# Altium project WirelessBoard_LCD20x4.PrjPcb
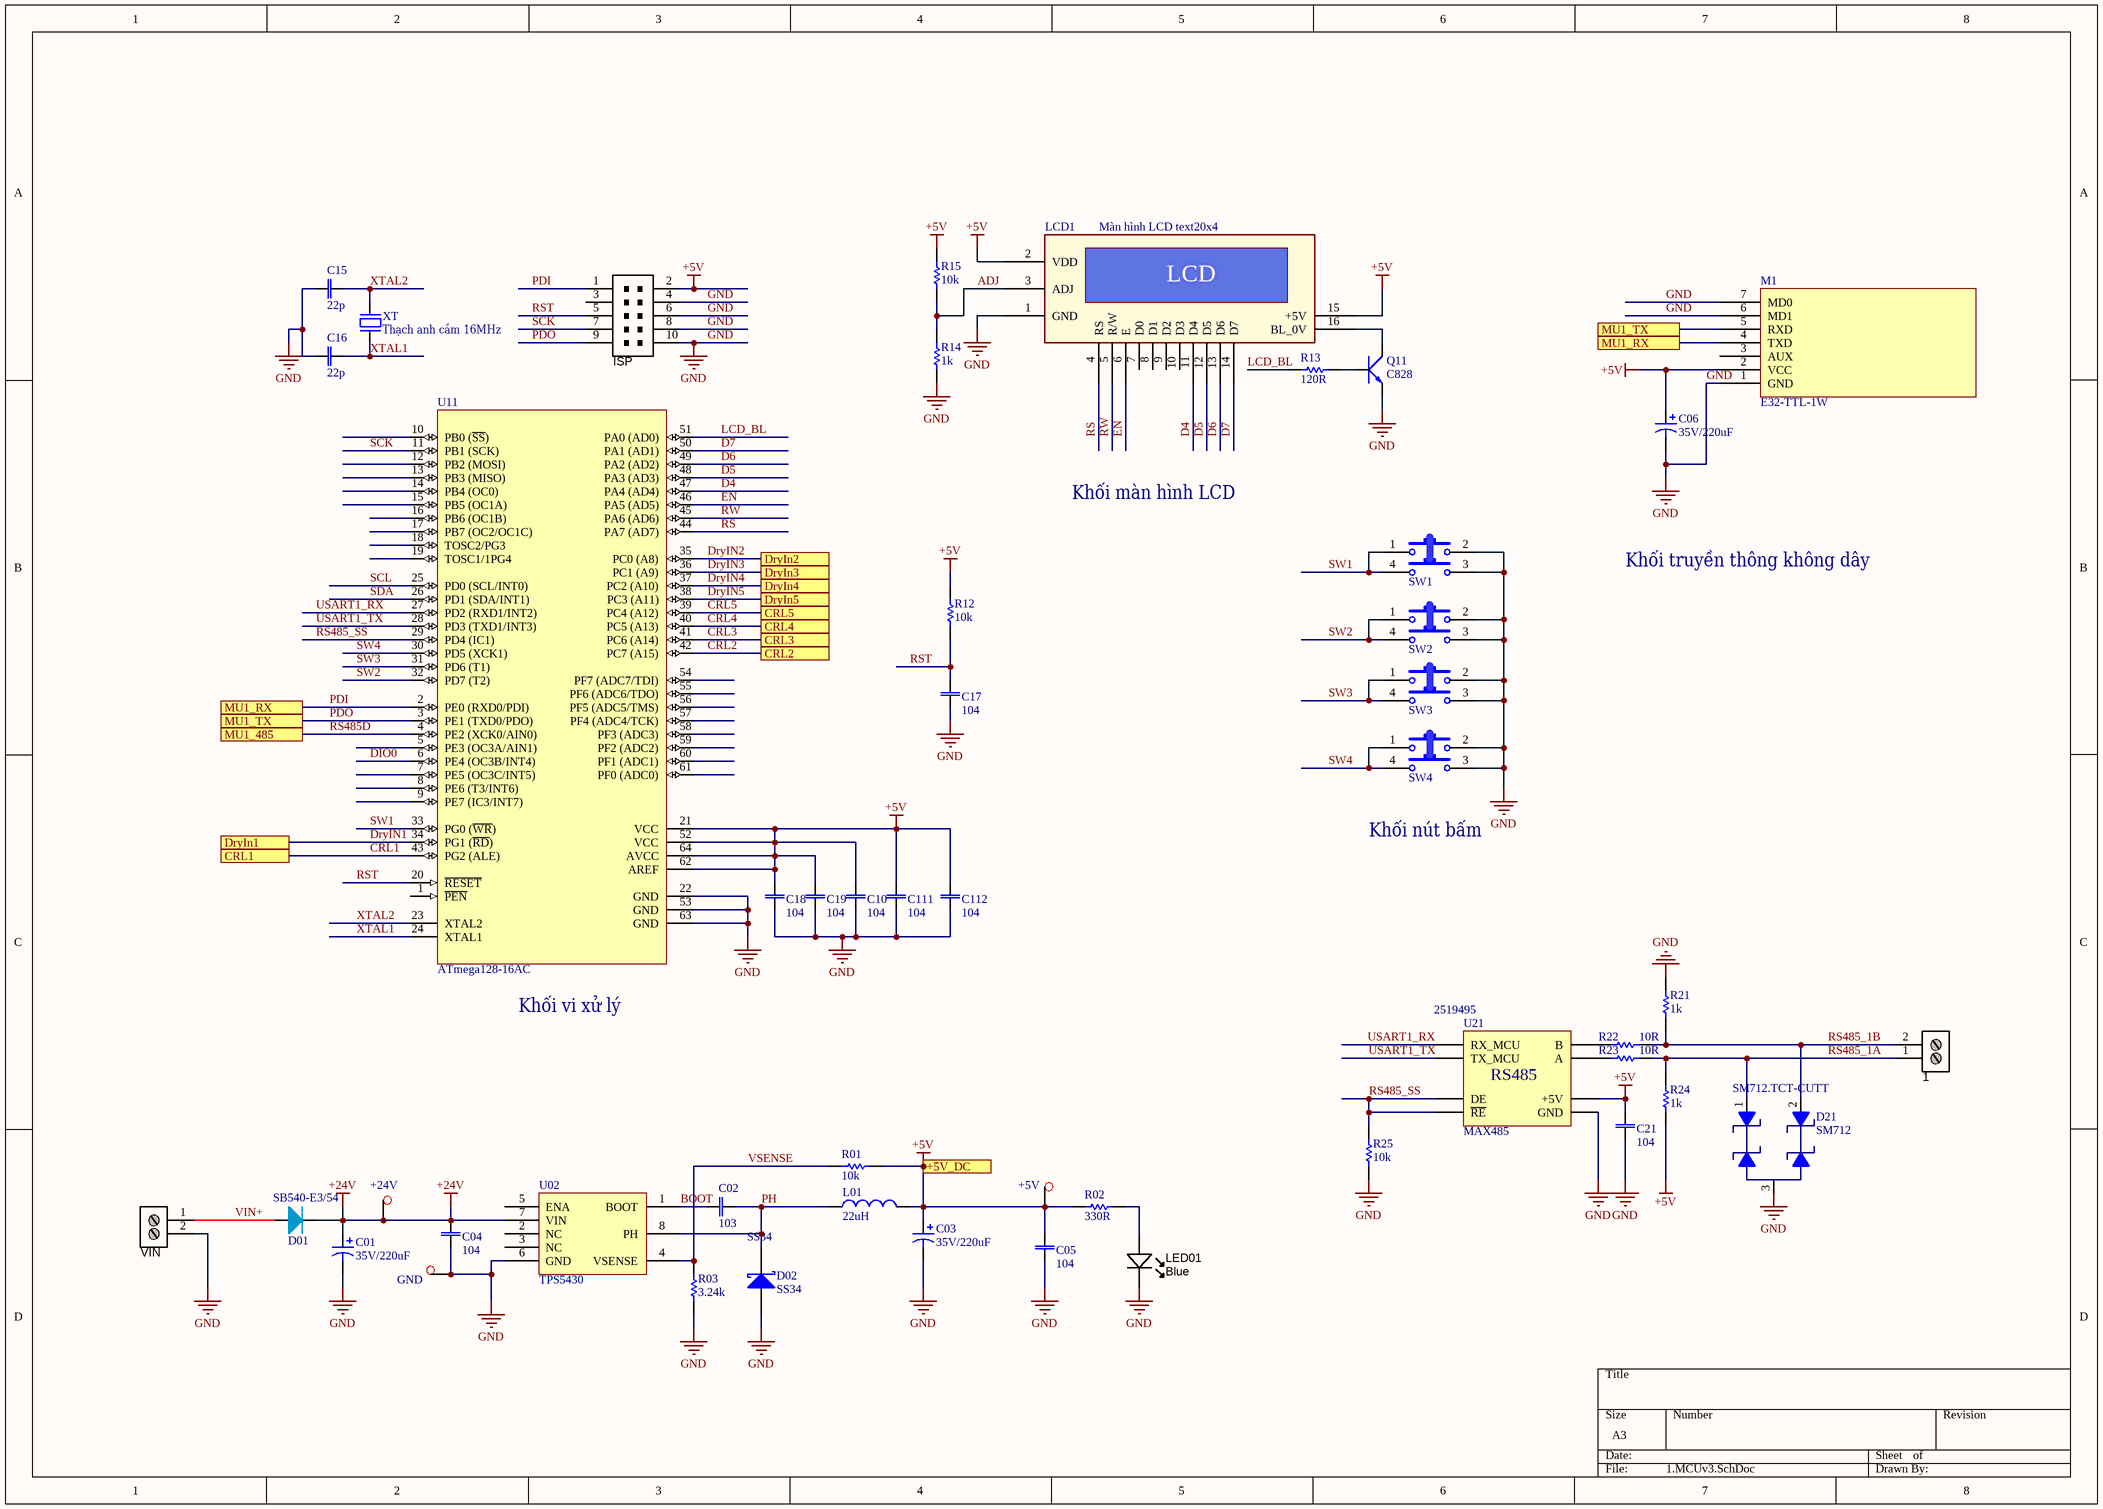
[diagram p0: 1.MCUv3.SchDoc]
2 sheets, 72 parts. Net scope: flat (ports and power ports of the same name join across sheets).
Board file: WirelessBoard_LCD20x4v2.PcbDoc
Sheets:
  1.MCUv3.SchDoc
  3.Relayv2.SchDoc

## Sheet 1.MCUv3.SchDoc
size A3; PageSetup: Record=PageOptions|CenterHorizontal=True|CenterVertical=True|PrintScale=0.73|XCorrection=1.00|YCorrection=1.00|PrintKind=1|BorderSize=5000000|LeftOffset=0|BottomOffset=0|Orientation=2|PaperLength=1000|PaperWidth=1000|Scale=100|PaperSource=7|PrintQuality=-3|MediaType=1|DitherType=10|PrintScaleMode=1|PaperKind=A4|PaperIndex=9

### Parts
1  Giắc xanh 5.08mm  [2P_PCB1]  (value not drawn)
+5V  TP  [TP2]  (value not drawn)
+24V  TP  [TP2]  (value not drawn)
C01  value 35V/220uF  [CAPE3.5-5.0MM_Rad_10x14mm]  (hidden comment: Tụ nhôm cắm35V/220uF)
C02  value 103  [CAP 0805]  (hidden comment: Tụ điện dán 0805103)
C03  value 35V/220uF  [CAPE3.5-5.0MM_Rad_10x14mm]  (hidden comment: Tụ nhôm cắm35V/220uF)
C04  value 104  [CAP 0805]  (hidden comment: Tụ điện dán 0805104)
C05  value 104  [CAP 0805]  (hidden comment: Tụ điện dán 0805104)
C06  value 35V/220uF  [CAPE3.5-5.0MM_Rad_10x14mm]  (hidden comment: Tụ nhôm cắm35V/220uF)
C10  value 104  [CAP 0805]  (hidden comment: Tụ điện dán 0805104)
C15  value 22p  [CAP 0805]  (hidden comment: Tụ điện dán 080522p)
C16  value 22p  [CAP 0805]  (hidden comment: Tụ điện dán 080522p)
C17  value 104  [CAP 0805]  (hidden comment: Tụ điện dán 0805104)
C18  value 104  [CAP 0805]  (hidden comment: Tụ điện dán 0805104)
C19  value 104  [CAP 0805]  (hidden comment: Tụ điện dán 0805104)
C21  value 104  [CAP 0805]  (hidden comment: Tụ điện dán 0805104)
C111  value 104  [CAP 0805]  (hidden comment: Tụ điện dán 0805104)
C112  value 104  [CAP 0805]  (hidden comment: Tụ điện dán 0805104)
D01  Supplier Part Number 1: SB540-E3/54  [DO-214AA]  (hidden comment: Đi ốt dánchân DO-214AB)
D02  SS34  [SMD diode]
D21  SM712  Supplier Part Number 1: SM712.TCT-CUTT  [SOT23 TOP]
GND  TP  [TP2]  (value not drawn)
ISP  Giắc đôi 5x2 chân 2.54mm  [10P_PCB_HEADER_BRD_MNT]  (value not drawn)
L01  value 22uH  [Inductor 12x12x6]  (hidden comment: Cuộn cảm dán22uH)
LCD1  Màn hình LCD text20x4  [LCD 20x4]
LED01  Blue  [LED-0805-K]
M1  value E32-TTL-1W  [RF_AS32]
Q11  C828  [SOT23 TOP]
R01  value 10k  [RES 0805]  (hidden comment: Điện trở dán 080510k)
R02  value 330R  [RES 0805]  (hidden comment: Điện trở dán 0805330R)
R03  value 3.24k  [RES 0805]  (hidden comment: Điện trở dán 08053.24k)
R12  value 10k  [RES 0805]  (hidden comment: Điện trở dán 080510k)
R13  value 120R  [RES 0805]  (hidden comment: Điện trở dán 0805120R)
R14  value 1k  [RES 0805]  (hidden comment: Điện trở dán 08051k)
R15  value 10k  [RES 0805]  (hidden comment: Điện trở dán 080510k)
R21  value 1k  [RES 0805]  (hidden comment: Điện trở dán 08051k)
R22  value 10R  [RES 0805]  (hidden comment: Điện trở dán 080510R)
R23  value 10R  [RES 0805]  (hidden comment: Điện trở dán 080510R)
R24  value 1k  [RES 0805]  (hidden comment: Điện trở dán 08051k)
R25  value 10k  [RES 0805]  (hidden comment: Điện trở dán 080510k)
SW1  Nút bấm 4 chân cắm12x12x6mm  [SW 12x12x4]  (value not drawn)
SW2  Nút bấm 4 chân cắm12x12x6mm  [SW 12x12x4]  (value not drawn)
SW3  Nút bấm 4 chân cắm12x12x6mm  [SW 12x12x4]  (value not drawn)
SW4  Nút bấm 4 chân cắm12x12x6mm  [SW 12x12x4]  (value not drawn)
U02  TPS5430  [SOIC 8]
U11  ATmega128-16AC  [64A_N]
U21  vl2: MAX485  Supplier Part Number 1: 2519495  [SOIC 8]  (hidden comment: MAX4858 chân cắm)
VIN  Giắc xanh 5.08mm  [2P_PCB1]  (value not drawn)
XT  Thạch anh cắm 16MHz  [XT2]

### Ports
+5V_DC, CRL1, CRL2, CRL3, CRL4, CRL5, DryIn1, DryIn2, DryIn3, DryIn4, DryIn5, MU1_485, MU1_RX, MU1_TX

### Nets
+5V: +5V.1 C03.1 C05.2 C06.1 C10.2 C18.2 C19.2 C21.1 C111.2 C112.2 ISP.2 L01.2 LCD1.2(VDD) LCD1.15(+5V) M1.2(VCC) R01.1 R02.2 R12.2 R15.2 R24.1 U11.21(VCC) U11.52(VCC) U11.62(AREF) U11.64(AVCC) U21.8(+5V) ; port +5V_DC
+24V: +24V.1 C01.1 C04.2 D01.2(K) U02.7(VIN)
GND: C01.2 C03.2 C04.1 C05.1 C06.2 C10.1 C15.2 C16.2 C17.1 C18.1 C19.1 C21.2 C111.1 C112.1 D02.1(A) D21.3(GND) GND.1 ISP.4 ISP.6 ISP.8 ISP.10 LCD1.1(GND) LED01.K M1.1(GND) M1.6(MD1) M1.7(MD0) Q11.3(E) R03.1 R14.1 R21.2 R25.1 SW1.2 SW1.3 SW2.2 SW2.3 SW3.2 SW3.3 SW4.2 SW4.3 U02.6(GND) U11.22(GND) U11.53(GND) U11.63(GND) U21.5(GND) VIN.2
ADJ: LCD1.3(ADJ) R14.2 R15.1
BOOT: C02.1 U02.1(BOOT)
CRL1: U11.43(PG2_(ALE)) ; port CRL1
CRL2: U11.42(PC7_(A15)) ; port CRL2
CRL3: U11.41(PC6_(A14)) ; port CRL3
CRL4: U11.40(PC5_(A13)) ; port CRL4
CRL5: U11.39(PC4_(A12)) ; port CRL5
D4: LCD1.11(D4) U11.47(PA4_(AD4))
D5: LCD1.12(D5) U11.48(PA3_(AD3))
D6: LCD1.13(D6) U11.49(PA2_(AD2))
D7: LCD1.14(D7) U11.50(PA1_(AD1))
DIO0: U11.6(PE4_(OC3B/INT4))
DryIN1: U11.34(PG1_(~{RD})) ; port DryIn1
DryIN2: U11.35(PC0_(A8)) ; port DryIn2
DryIN3: U11.36(PC1_(A9)) ; port DryIn3
DryIN4: U11.37(PC2_(A10)) ; port DryIn4
DryIN5: U11.38(PC3_(A11)) ; port DryIn5
EN: LCD1.6(E) U11.46(PA5_(AD5))
LCD_BL: R13.2 U11.51(PA0_(AD0))
PDI: ISP.1 M1.4(TXD) U11.2(PE0_(RXD0/PDI)) ; port MU1_RX
PDO: ISP.9 M1.5(RXD) U11.3(PE1_(TXD0/PDO)) ; port MU1_TX
PH: C02.2 D02.2(K) L01.1 U02.8(PH)
RS: LCD1.4(RS) U11.44(PA7_(AD7))
RS485_1A: 1.1 D21.1(IO1) R23.2 R24.2
RS485_1B: 1.2 D21.2(IO2) R21.1 R22.2
RS485_SS: R25.2 U11.29(PD4_(IC1)) U21.2(~{RE}) U21.3(DE)
RS485D: U11.4(PE2_(XCK0/AIN0)) ; port MU1_485
RST: C17.2 ISP.5 R12.1 U11.20(~{RESET})
RW: LCD1.5(R/W) U11.45(PA6_(AD6))
SCK: ISP.7 U11.11(PB1_(SCK))
SCL: U11.25(PD0_(SCL/INT0))
SDA: U11.26(PD1_(SDA/INT1))
SW1: SW1.1 SW1.4 U11.33(PG0_(~{WR}))
SW2: SW2.1 SW2.4 U11.32(PD7_(T2))
SW3: SW3.1 SW3.4 U11.31(PD6_(T1))
SW4: SW4.1 SW4.4 U11.30(PD5_(XCK1))
USART1_RX: U11.27(PD2_(RXD1/INT2)) U21.1(RX_MCU)
USART1_TX: U11.28(PD3_(TXD1/INT3)) U21.4(TX_MCU)
VIN+: D01.1(A) VIN.1
VSENSE: R01.2 R03.2 U02.4(VSENSE)
XTAL1: C16.1 U11.24(XTAL1) XT.1
XTAL2: C15.1 U11.23(XTAL2) XT.2
NetLCD1_16: LCD1.16(BL_0V) Q11.2(C)
NetLED01_A: LED01.A R02.1
NetQ11_1: Q11.1(B) R13.1
NetR22_1: R22.1 U21.7(B)
NetR23_1: R23.1 U21.6(A)

Not connected (* = marked no-connect by the designer): ISP 3; LCD1 7(D0) 8(D1) 9(D2) 10(D3); M1 3(AUX); U02 2(NC) 3(NC) 5(ENA); U11 1(~{PEN}) 5(PE3_(OC3A/AIN1)) 7(PE5_(OC3C/INT5)) 8(PE6_(T3/INT6)) 9(PE7_(IC3/INT7)) 10(PB0_(~{SS})) 12(PB2_(MOSI)) 13(PB3_(MISO)) 14(PB4_(OC0)) 15(PB5_(OC1A)) 16(PB6_(OC1B)) 17(PB7_(OC2/OC1C)) 18(TOSC2/PG3) 19(TOSC1/1PG4) 54(PF7_(ADC7/TDI)) 55(PF6_(ADC6/TDO)) 56(PF5_(ADC5/TMS)) 57(PF4_(ADC4/TCK)) 58(PF3_(ADC3)) 59(PF2_(ADC2)) 60(PF1_(ADC1)) 61(PF0_(ADC0))

### Notes on the sheet
- Khối màn hình LCD
- Khối truyền thông không dây
- (near SW4) Khối nút bấm
- Khối vi xử lý
- (in symbol LCD 16x2) LCD

### Library data of the parts
1 VIN = 2P_ScrewTerm_90S_3.81MM: Terminal Block Screw Type THT 2-Position 3.81mm pitch; Manufacturer 1: Tyco Electronics; Manufacturer Part Number 1: 1776113-2; Value: 2 position; Pitch: 0.150" (3.81mm); Positions Per Level: 2; Package / Case: Side Entry; 3.81mm pitch; Category: Connectors Interconnects; Color: Black; Supplier 1: Digi-Key; Supplier Part Number 1: A97976-ND; vl: Giắc xanh 5.08mm
C01 C03 C06 = Cap: cm: Tụ nhôm cắm
C02 C04 C05 C10 C15-C19 C21 C111 C112 = CAP NP: Capacitor non polarized; cm1: Tụ điện dán 0603; cm3: Tụ điện dán 1206; cm2: Tụ điện dán 0805
D01 = Diode: pin to pad: 1>A 2>K; Manufacturer: Vishay; cm1: Đi ốt cắm; vl2: FR307; vl3: TVS 1.5KE300A 19A 300V; vl4: HER508 5A 1000V; Forward Voltage: 480mV; Average Rectified Current: 5A; Max Repetitive Reverse Voltage (Vrrm): 40V; Peak Non-Repetitive Surge Current: 220A; Element Configuration: Single; Peak Reverse Current: 500uA; Polarity: Standard; cm2: Đi ốt dán; vl5: chân DO-214AB; Supplier 1: Arrow; Manufacturer Part Number: SB540-E3/54; Stock 1: 3694; Pricing 1: 1=0.429, 10=0.3503, 25=0.3488, 100=0.2783, 250=0.2775, 500=0.2374, 1000=0.2369, 3000=0.1681 (USD); Mount: Through Hole; Number of Pins: 2; Min Operating Temperature: -65°C; Max Operating Temperature: 150°C; Packaging: Cut Tape; Forward Current: 5A; Max Forward Surge Current (Ifsm): 220A; Output Current: 5A; Current: 5A; Voltage: 40V; Diameter: 5.3mm; Length: 10mm; Height: 5.8mm; Width: 5.8mm; Lead Free: Lead Free; REACH SVHC: Unknown; ComponentLink1URL: http://uk.rs-online.com/webdocs/13d1/0900766b813d1b4c.pdf; ComponentLink1Description: http://uk.rs-online.com/webdocs/13d1/0900766b813d1b4c.pdf; ComponentLink2URL: https://produktinfo.conrad.com/datenblaetter/150000-174999/164089-da-01-en-SCHOTTKY_DIODE_SB540_E3_54__DO201AD__VIS.pdf; ComponentLink2Description: https://produktinfo.conrad.com/datenblaetter/150000-174999/164089-da-01-en-SCHOTTKY_DIODE_SB540_E3_54__DO201AD__VIS.pdf
D02 = Diode Schottky: pin to pad: 1>A 2>K; Manufacturer: ON Semiconductor / Fairchild; Forward Current: 3A; Element Configuration: Single; Forward Voltage: 500mV; Max Repetitive Reverse Voltage (Vrrm): 40V; Peak Reverse Current: 500uA; Peak Non-Repetitive Surge Current: 100A; Polarity: Standard; Number of Elements: 1; Max Power Dissipation: 2.27W; Supplier 1: Avnet; Supplier Part Number 1: SS34; Manufacturer Part Number: SS34; Stock 1: 0; Pricing 1: 1=0.4069, 30=0.3809, 75=0.2979, 150=0.2569, 375=0.1819 (USD); Mount: Surface Mount; Case/Package: SMC; Number of Pins: 2; Contact Plating: Matte,Tin; Number of Terminals: 2; Min Operating Temperature: -55°C; Max Operating Temperature: 150°C; Packaging: Tape and Reel; Package Quantity: 1; Average Rectified Current: 3A; Max Forward Surge Current (Ifsm): 100A; Max Reverse Voltage (DC): 40V; Max Surge Current: 100A; Max Reverse Leakage Current: 500uA; Voltage Rating (DC): 40V; Current Rating: 3A; Output Current: 3A; Current: 3A; Voltage: 40V; Length: 7.15mm; Height: 2.75mm; Width: 6.25mm; Radiation Hardening: No; REACH SVHC: No SVHC; Lead Free: Lead Free; ComponentLink1URL: https://www.fairchildsemi.com/datasheets/SS/SS39.pdf; ComponentLink1Description: https://www.fairchildsemi.com/datasheets/SS/SS39.pdf; ComponentLink2URL: http://www.mouser.com/ds/2/149/SS34-197057.pdf; ComponentLink2Description: http://www.mouser.com/ds/2/149/SS34-197057.pdf; ComponentLink3URL: http://www.jameco.com/Jameco/Products/ProdDS/1090087.pdf; ComponentLink3Description: http://www.jameco.com/Jameco/Products/ProdDS/1090087.pdf; ComponentLink4URL: https://www.fairchildsemi.com/package-drawings/DO/DO214AB.pdf; ComponentLink4Description: https://www.fairchildsemi.com/package-drawings/DO/DO214AB.pdf; ComponentLink5URL: http://www.farnell.com/datasheets/1774678.pdf; ComponentLink5Description: http://www.farnell.com/datasheets/1774678.pdf; ComponentLink6URL: http://www.jameco.com/Jameco/Products/ProdDS/1547649.pdf; ComponentLink6Description: http://www.jameco.com/Jameco/Products/ProdDS/1547649.pdf
D21 = Diode SM712: The SM712 transient voltage suppressor (TVS) diode  is designed for asymmetrical (12V to -7V) protection  in multi-point data transmission standard RS-485  applications.; pin to pad: 2>3 3>2; Manufacturer: Semtech; Manufacturer Part Number: SM712.TCT; Direction: Bidirectional; Min Breakdown Voltage: 7.5V; Clamping Voltage: 26V; Peak Pulse Power: 400W; Leakage Current: 1uA; Peak Pulse Current: 17A; Element Configuration: Dual; Number of Bidirectional Channels: 2; Power Line Protection: No; Breakdown Voltage: 13.3V; Test Current: 1mA; ESD Protection: Yes; Max Reverse Leakage Current: 20uA; Supplier 1: Future Electronics; Stock 1: 4629; Pricing 1: 1=1.23, 250=0.585, 500=0.53, 750=0.505, 1500=0.415 (USD); Mount: Surface Mount; Case/Package: SOT-23; Number of Pins: 3; Min Operating Temperature: -55°C; Max Operating Temperature: 125°C; Packaging: Tape and Reel; Reverse Standoff Voltage: 12V; Working Voltage: 12V; Max Power Dissipation: 400W; Composition: Zener; Polarity: Bidirectional; Number of Elements: 2; Reverse Breakdown Voltage: 13.3V; Power Dissipation: 400W; Max Breakdown Voltage: 13.3V; Voltage Rating (DC): 12V; Length: 2.9mm; Height: 0.95mm; Depth: 1.3mm; Width: 1.3mm; Radiation Hardening: No; Lead Free: Lead Free; REACH SVHC: No SVHC; ComponentLink1URL: http://www.semtech.com/images/datasheet/sm712.pdf; ComponentLink1Description: http://www.semtech.com/images/datasheet/sm712.pdf; ComponentLink2URL: https://www.semtech.com/uploads/documents/sm712.pdf; ComponentLink2Description: https://www.semtech.com/uploads/documents/sm712.pdf; ComponentLink3URL: https://www.verical.com/server-webapp/html/getDatasheet?partID=110620; ComponentLink3Description: https://www.verical.com/server-webapp/html/getDatasheet?partID=110620; ComponentLink4URL: http://www.farnell.com/datasheets/1921267.pdf; ComponentLink4Description: http://www.farnell.com/datasheets/1921267.pdf; ComponentLink5URL: http://www.farnell.com/datasheets/579001.pdf; ComponentLink5Description: http://www.farnell.com/datasheets/579001.pdf
ISP = CONN_HEADER_2x5P_0.100in_Male: Header THD 10 POS Double-row 2.54mm pitch; Manufacturer 1: 3M; Manufacturer Part Number 1: D2510-6002-AR; Pitch: 0.100" (2.54mm); Value: Double-row, 10 positions; QtyOverride: 1; Connector Type: Header, Shrouded; Number of Positions: 10; Package / Case: Connector header; 2.54mm pitch; Contact Type: Male Pin; Number of Rows: 2; Row Spacing: 0.100" (2.54mm); Contact Mating Length: 0.243" (6.17mm); ComponentLink1URL: http://multimedia.3m.com/mws/mediawebserver?66666UuZjcFSLXTtm8T_oxMcEVuQEcuZgVs6EVs6E666666--; ComponentLink1Description: http://multimedia.3m.com/mws/mediawebserver?66666UuZjcFSLXTtm8T_oxMcEVuQEcuZgVs6EVs6E666666--; Supplier 1: Digi-Key; Supplier Part Number 1: MHC10E-ND
L01 = Inductor: cm2: Cuộn cảm cắm; cm1: Cuộn cảm dán
LCD1 = LCD 16x2: Text LCD; vl1: 16x2; vl2: 20x4; cm1: Màn hình LCD text
LED01 = LED_SMD_Blue_0805_100mcd: LED 0805 SMD Blue 100mcd 470nm; Manufacturer 1: Ligitek; Manufacturer Part Number 1: LG-170DBKZ-CT; Material: InGaN/GaN; Ratings: 100 mcd; 470 nm; Package / Case: 0805; Value: Blue; Color: Blue
M1 = AS32-TTL-1W: Type1: Module thu phát không dây RF
Q11 = NPN: Transistor C828 C1815....
R01 R02 R03 R12-R15 R21-R25 = Res: Resistor; cm1: Điện trở dán 0603; cm2: Điện trở cắm 1/4W; cm4: Điện trở dán 1206; cm3: Điện trở dán 0805
SW1-SW4 = SW-4P-Small: cm1: Nút bấm 4 chân cắm; vl1: 12x12x6mm
U11 = ATmega128-16AC: 8-Bit AVR Microcontroller with 128K Bytes of In-System Programmable Flash Memory; Published: 17-Sep-2003; LatestRevisionDate: 13-Apr-2006; LatestRevisionNote: IPC-7351 Footprint Added.; DatasheetVersion: 2467G-AVR-09/02; PackageVersion: revB, Oct-2001; PackageReference: 64A; Publisher: Altium Limited; PackageDescription: 64-Pin Thin Quad Flat Pack 0.8 mm Pitch; Code_JEDEC: MS-026-AEB; ComponentLink1Description: Manufacturer Link; ComponentLink1URL: http://www.atmel.com; ComponentLink2Description: Datasheet; ComponentLink2URL: http://www.atmel.com/dyn/resources/prod_documents/doc2467.pdf
U21 = 485: RS485; Manufacturer: Maxim; Manufacturer Part Number: MAX485CSA+; vl1: SN75176; cm2: 8 chân dán; Description: IC TXRX RS485/RS422 LOWPWR 8SOIC; Number of Transmitters: 1; Operating Supply Voltage: 5V; Data Rate: 2.5Mbps; Logic Function: Transceiver; Min Supply Voltage: 4.75V; Max Supply Voltage: 5.25V; Interface: RS-422,RS-485; Simplex/Duplex: Half Duplex; Nominal Supply Current: 500uA; cm1: 8 chân cắm; Supplier 1: Farnell; Stock 1: 2098; Pricing 1: 1=1.49, 10=1.42, 25=1.36, 50=1.35, 100=1.34, 250=1.33, 500=1.32, 1000=1.31 (GBP); Mount: Surface Mount; Case/Package: SOIC; Number of Pins: 8; Weight: 0.01787oz; Contact Plating: Matte,Tin; Min Operating Temperature: 0°C; Max Operating Temperature: 70°C; Packaging: Rail/Tube; Package Quantity: 100; Number of Receivers: 1; Number of Drivers: 1; Number of Transceivers: 1; Operating Supply Current: 500uA; Voltage: 5V; Length: 5mm; Height: 1.5mm; Width: 4mm; Radiation Hardening: No; Lead Free: Lead Free; REACH SVHC: No SVHC; ComponentLink1URL: http://datasheets.maxim-ic.com/en/ds/MAX1487-MAX491.pdf; ComponentLink1Description: http://datasheets.maxim-ic.com/en/ds/MAX1487-MAX491.pdf; ComponentLink2URL: http://www.farnell.com/datasheets/1700964.pdf; ComponentLink2Description: http://www.farnell.com/datasheets/1700964.pdf; ComponentLink3URL: https://www.distrelec.biz/Web/Downloads/ta/_e/jwMAX481-491_data_e.pdf?mime=application%2Fpdf; ComponentLink3Description: https://www.distrelec.biz/Web/Downloads/ta/_e/jwMAX481-491_data_e.pdf?mime=application%2Fpdf; ComponentLink4URL: https://media.digikey.com/pdf/Data%20Sheets/Maxim%20PDFs/PartNumberBreakdown_ds.pdf; ComponentLink4Description: https://media.digikey.com/pdf/Data%20Sheets/Maxim%20PDFs/PartNumberBreakdown_ds.pdf; ComponentLink5URL: http://www.produktinfo.conrad.com/datenblaetter/150000-174999/170071-da-01-en-IC_MAX485CSA_SO8.pdf; ComponentLink5Description: http://www.produktinfo.conrad.com/datenblaetter/150000-174999/170071-da-01-en-IC_MAX485CSA_SO8.pdf
XT = Crystal

## Sheet 3.Relayv2.SchDoc
size A4; PageSetup: Record=PageOptions|CenterHorizontal=True|CenterVertical=True|PrintScale=1.00|XCorrection=1.00|YCorrection=1.00|PrintKind=1|BorderSize=5000000|LeftOffset=0|BottomOffset=0|Orientation=2|PaperLength=1000|PaperWidth=1000|Scale=100|PaperSource=15|PrintQuality=1200|MediaType=1|DitherType=10|PrintScaleMode=1|PaperKind=A4|PaperIndex=9
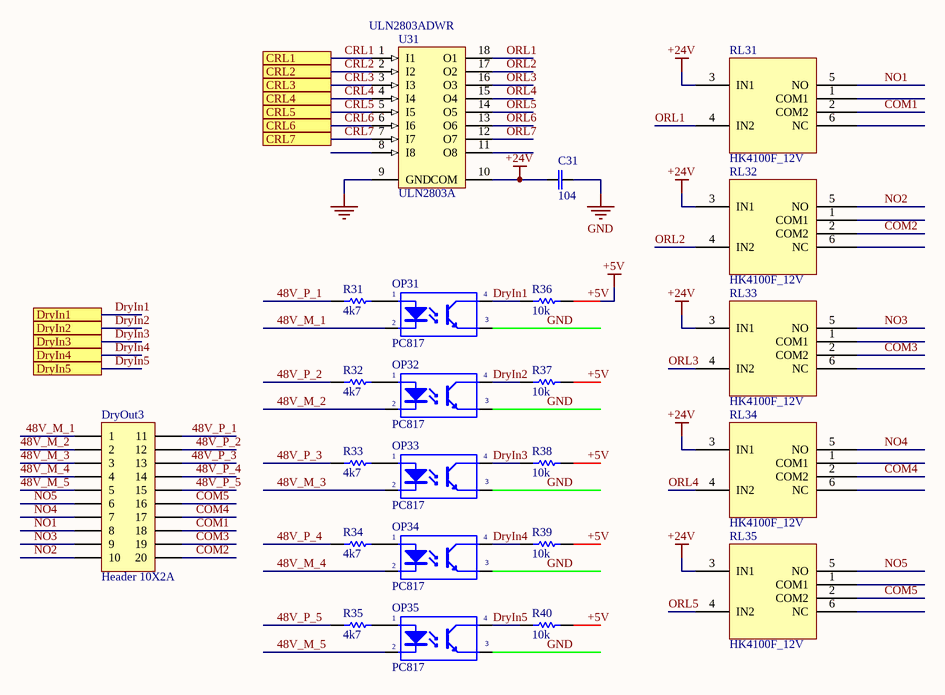
[diagram p1: 3.Relayv2.SchDoc]

### Parts
C31  value 104  [CAP 0805]  (hidden comment: Tụ điện dán 0805104)
DryOut3  Header 10X2A  [HDR2X10_CEN]
OP31  PC817  [DIP4/W0.3]
OP32  PC817  [DIP4/W0.3]
OP33  PC817  [DIP4/W0.3]
OP34  PC817  [DIP4/W0.3]
OP35  PC817  [DIP4/W0.3]
R31  value 4k7  [RESC3216N]  (hidden comment: Điện trở dán 12064k7)
R32  value 4k7  [RESC3216N]  (hidden comment: Điện trở dán 12064k7)
R33  value 4k7  [RESC3216N]  (hidden comment: Điện trở dán 12064k7)
R34  value 4k7  [RESC3216N]  (hidden comment: Điện trở dán 12064k7)
R35  value 4k7  [RESC3216N]  (hidden comment: Điện trở dán 12064k7)
R36  value 10k  [RES 0805]  (hidden comment: Điện trở dán 080510k)
R37  value 10k  [RES 0805]  (hidden comment: Điện trở dán 080510k)
R38  value 10k  [RES 0805]  (hidden comment: Điện trở dán 080510k)
R39  value 10k  [RES 0805]  (hidden comment: Điện trở dán 080510k)
R40  value 10k  [RES 0805]  (hidden comment: Điện trở dán 080510k)
RL31  HK4100F_12V  [HK4100F]
RL32  HK4100F_12V  [HK4100F]
RL33  HK4100F_12V  [HK4100F]
RL34  HK4100F_12V  [HK4100F]
RL35  HK4100F_12V  [HK4100F]
U31  ULN2803A  Supplier Part Number 1: ULN2803ADWR  [SOIC-18]

### Ports
CRL1, CRL2, CRL3, CRL4, CRL5, CRL6, CRL7, DryIn1, DryIn2, DryIn3, DryIn4, DryIn5

### Nets
+5V: R36.2 R37.2 R38.2 R39.2 R40.2
+24V: C31.2 RL31.3(IN1) RL32.3(IN1) RL33.3(IN1) RL34.3(IN1) RL35.3(IN1) U31.10(COM)
GND: C31.1 OP31.3(E) OP32.3(E) OP33.3(E) OP34.3(E) OP35.3(E) U31.9(GND)
48V_M_1: DryOut3.1 OP31.2(K)
48V_M_2: DryOut3.2 OP32.2(K)
48V_M_3: DryOut3.3 OP33.2(K)
48V_M_4: DryOut3.4 OP34.2(K)
48V_M_5: DryOut3.5 OP35.2(K)
48V_P_1: DryOut3.11 R31.1
48V_P_2: DryOut3.12 R32.1
48V_P_3: DryOut3.13 R33.1
48V_P_4: DryOut3.14 R34.1
48V_P_5: DryOut3.15 R35.1
COM1: DryOut3.18 RL31.2(COM2)
COM2: DryOut3.20 RL32.2(COM2)
COM3: DryOut3.19 RL33.2(COM2)
COM4: DryOut3.17 RL34.2(COM2)
COM5: DryOut3.16 RL35.2(COM2)
CRL1: U31.1(I1) ; port CRL1
CRL2: U31.2(I2) ; port CRL2
CRL3: U31.3(I3) ; port CRL3
CRL4: U31.4(I4) ; port CRL4
CRL5: U31.5(I5) ; port CRL5
CRL6: U31.6(I6) ; port CRL6
CRL7: U31.7(I7) ; port CRL7
DryIN1: OP31.4(C) R36.1 ; port DryIn1
DryIN2: OP32.4(C) R37.1 ; port DryIn2
DryIN3: OP33.4(C) R38.1 ; port DryIn3
DryIN4: OP34.4(C) R39.1 ; port DryIn4
DryIN5: OP35.4(C) R40.1 ; port DryIn5
NO1: DryOut3.8 RL31.5(NO)
NO2: DryOut3.10 RL32.5(NO)
NO3: DryOut3.9 RL33.5(NO)
NO4: DryOut3.7 RL34.5(NO)
NO5: DryOut3.6 RL35.5(NO)
ORL1: RL31.4(IN2) U31.18(O1)
ORL2: RL32.4(IN2) U31.17(O2)
ORL3: RL33.4(IN2) U31.16(O3)
ORL4: RL34.4(IN2) U31.15(O4)
ORL5: RL35.4(IN2) U31.14(O5)
ORL6: U31.13(O6)
ORL7: U31.12(O7)
NetOP31_1: OP31.1(A) R31.2
NetOP32_1: OP32.1(A) R32.2
NetOP33_1: OP33.1(A) R33.2
NetOP34_1: OP34.1(A) R34.2
NetOP35_1: OP35.1(A) R35.2

Not connected (* = marked no-connect by the designer): RL31 1(COM1) 6(NC); RL32 1(COM1) 6(NC); RL33 1(COM1) 6(NC); RL34 1(COM1) 6(NC); RL35 1(COM1) 6(NC); U31 8(I8) 11(O8)

### Library data of the parts
C31 = CAP NP: as C02 on sheet 1.MCUv3; cm2: Tụ điện dán 0805
DryOut3 = Header 10X2A: Header, 10-Pin, Dual row; LatestRevisionDate: 17-Jul-2002; LatestRevisionNote: Re-released for DXP Platform.; Publisher: Altium Limited
OP31-OP35 = PC817: Single Opto; Value: PC817
R31-R35 = Res: Resistor; cm1: Điện trở dán 0603; cm2: Điện trở cắm 1/4W; cm3: Điện trở dán 0805; cm4: Điện trở dán 1206
R36-R40 = Res: as R01 on sheet 1.MCUv3; cm3: Điện trở dán 0805
RL31-RL35 = HK4100F
U31 = ULN2803A: High-Voltage, High-Current Darlington Array; Manufacturer: Texas Instruments; Description: TEXAS INSTRUMENTS   ULN2803ADWR..   Bipolar Transistor Array, Darlington, NPN, 50 V, 500 mA, SOIC; Polarity: NPN; Collector Emitter Voltage (VCEO): 50V; Number of Elements: 8; Collector Emitter Saturation Voltage: 1.1V; Max Collector Current: 500mA; LatestRevisionNote: Stylized 3D Model Added.; Publisher: Altium Limited; Value: ULN2803A; Supplier 1: Arrow; Manufacturer Part Number: ULN2803ADWR; Stock 1: 6620; Pricing 1: 2000=0.5499, 10000=0.5312, 1=0.5547, 2001=0.509 (USD); Mount: Surface Mount; Case/Package: SOIC; Number of Pins: 18; Contact Plating: Gold; Min Operating Temperature: -65°C; Max Operating Temperature: 150°C; Collector Emitter Breakdown Voltage: 50V; Packaging: Tape and Reel; Package Quantity: 1; Number of Drivers: 8; Voltage Rating (DC): 50V; Current Rating: 500mA; Length: 11.62mm; Height: 2.35mm; Width: 7.52mm; Radiation Hardening: No; Lead Free: Lead Free; REACH SVHC: No SVHC; ComponentLink1URL: http://www.ti.com/general/docs/lit/getliterature.tsp?genericPartNumber=ULN2803A&amp;&amp;fileType=pdf; ComponentLink1Description: http://www.ti.com/general/docs/lit/getliterature.tsp?genericPartNumber=ULN2803A&amp;&amp;fileType=pdf; ComponentLink2URL: https://www.verical.com/server-webapp/html/getDatasheet?partID=134747; ComponentLink2Description: https://www.verical.com/server-webapp/html/getDatasheet?partID=134747; ComponentLink3URL: http://www.farnell.com/datasheets/1992213.pdf; ComponentLink3Description: http://www.farnell.com/datasheets/1992213.pdf; ComponentLink4URL: http://www.jameco.com/Jameco/Products/ProdDS/1927351.pdf; ComponentLink4Description: http://www.jameco.com/Jameco/Products/ProdDS/1927351.pdf; ComponentLink5URL: http://www.ti.com/lit/ds/symlink/uln2803a.pdf; ComponentLink5Description: http://www.ti.com/lit/ds/symlink/uln2803a.pdf; ComponentLink6URL: http://www.farnell.com/datasheets/1887697.pdf; ComponentLink6Description: http://www.farnell.com/datasheets/1887697.pdf; ComponentLink7URL: http://www.farnell.com/datasheets/2020638.pdf; ComponentLink7Description: http://www.farnell.com/datasheets/2020638.pdf

## Nets that join several sheets
+5V: 1.MCUv3 (25 pins), 3.Relayv2 (5 pins)
+24V: 1.MCUv3 (5 pins), 3.Relayv2 (7 pins)
GND: 1.MCUv3 (45 pins), 3.Relayv2 (7 pins)
CRL1: 1.MCUv3 (U11.43), 3.Relayv2 (U31.1)
CRL2: 1.MCUv3 (U11.42), 3.Relayv2 (U31.2)
CRL3: 1.MCUv3 (U11.41), 3.Relayv2 (U31.3)
CRL4: 1.MCUv3 (U11.40), 3.Relayv2 (U31.4)
CRL5: 1.MCUv3 (U11.39), 3.Relayv2 (U31.5)
DryIN1: 1.MCUv3 (U11.34), 3.Relayv2 (OP31.4 R36.1)
DryIN2: 1.MCUv3 (U11.35), 3.Relayv2 (OP32.4 R37.1)
DryIN3: 1.MCUv3 (U11.36), 3.Relayv2 (OP33.4 R38.1)
DryIN4: 1.MCUv3 (U11.37), 3.Relayv2 (OP34.4 R39.1)
DryIN5: 1.MCUv3 (U11.38), 3.Relayv2 (OP35.4 R40.1)